# EasyEDA Pro project PCB_ArduinoArcadeCardReader_ESP32C3MINI.epro

# Board PCB_PCB_Aime_card_reader_ESP32C3MINI_2024-11-08
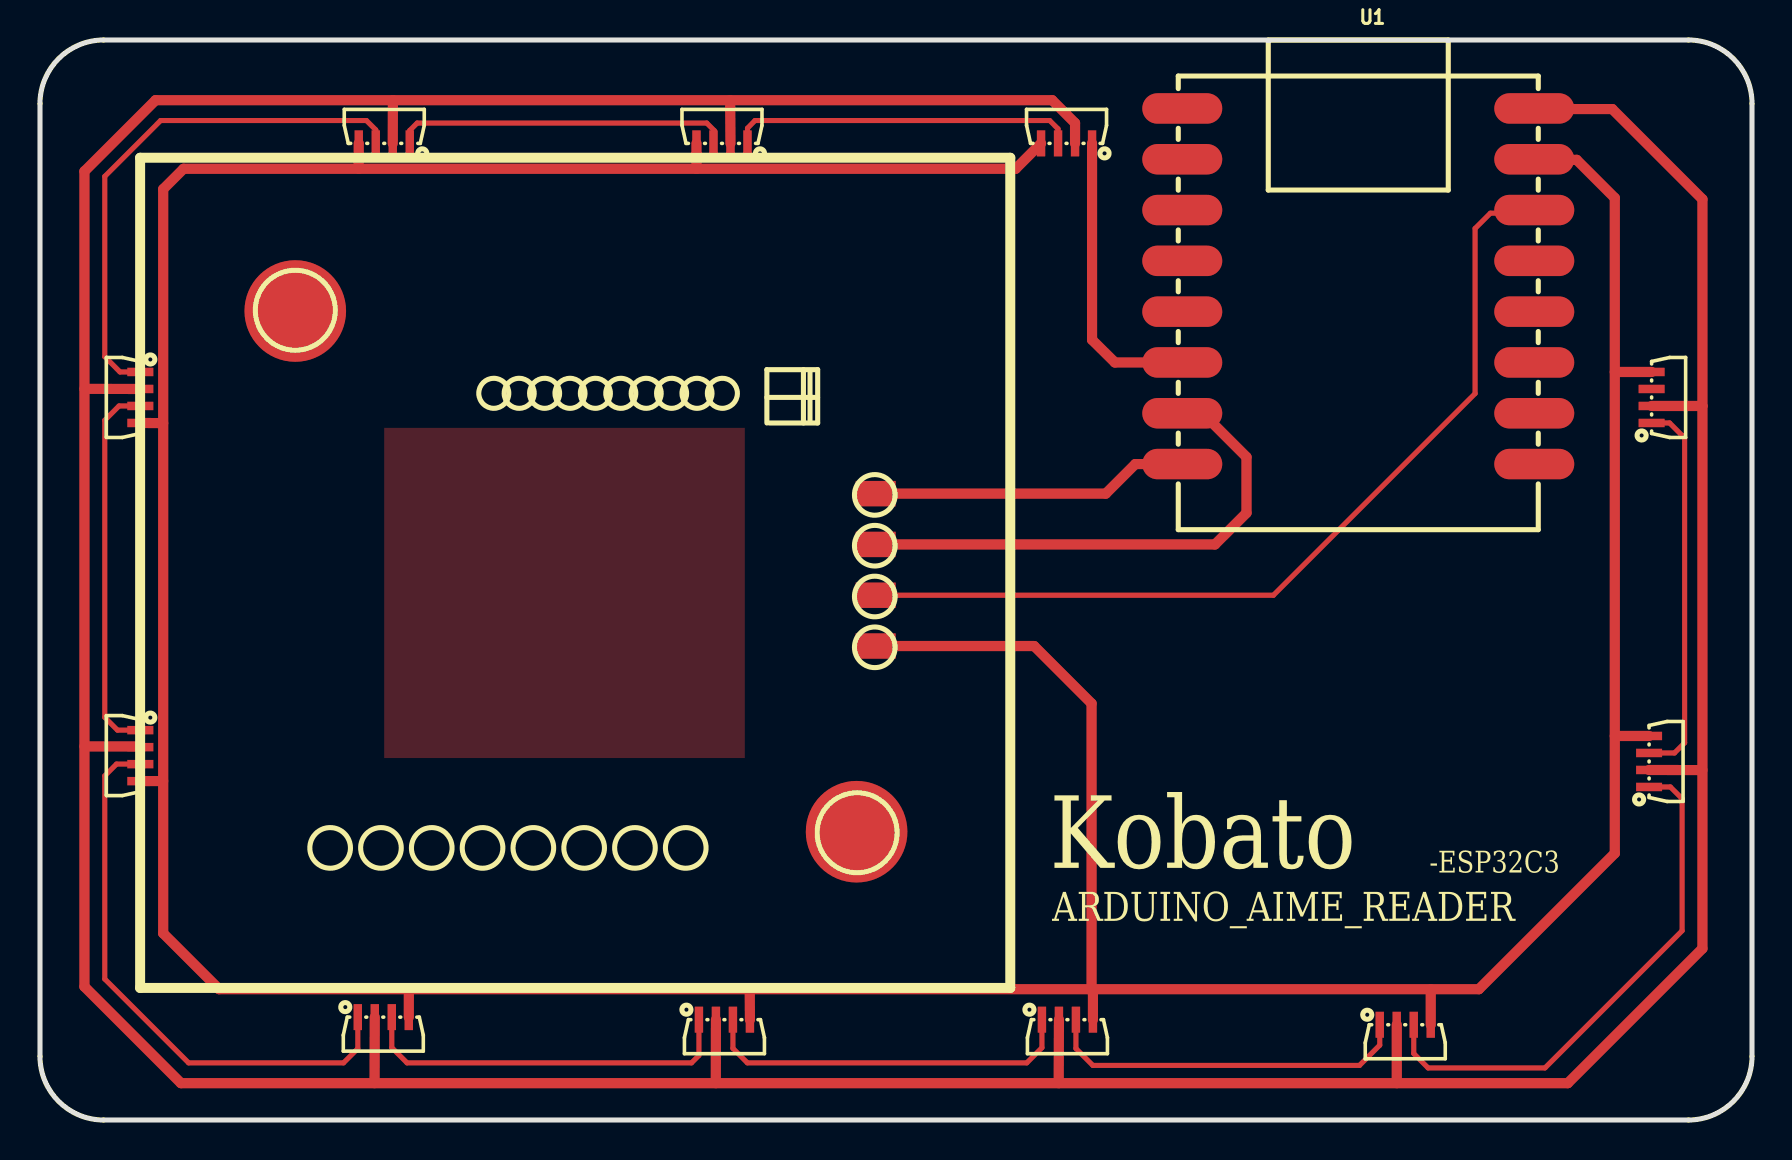
[diagram p0: board, top side]
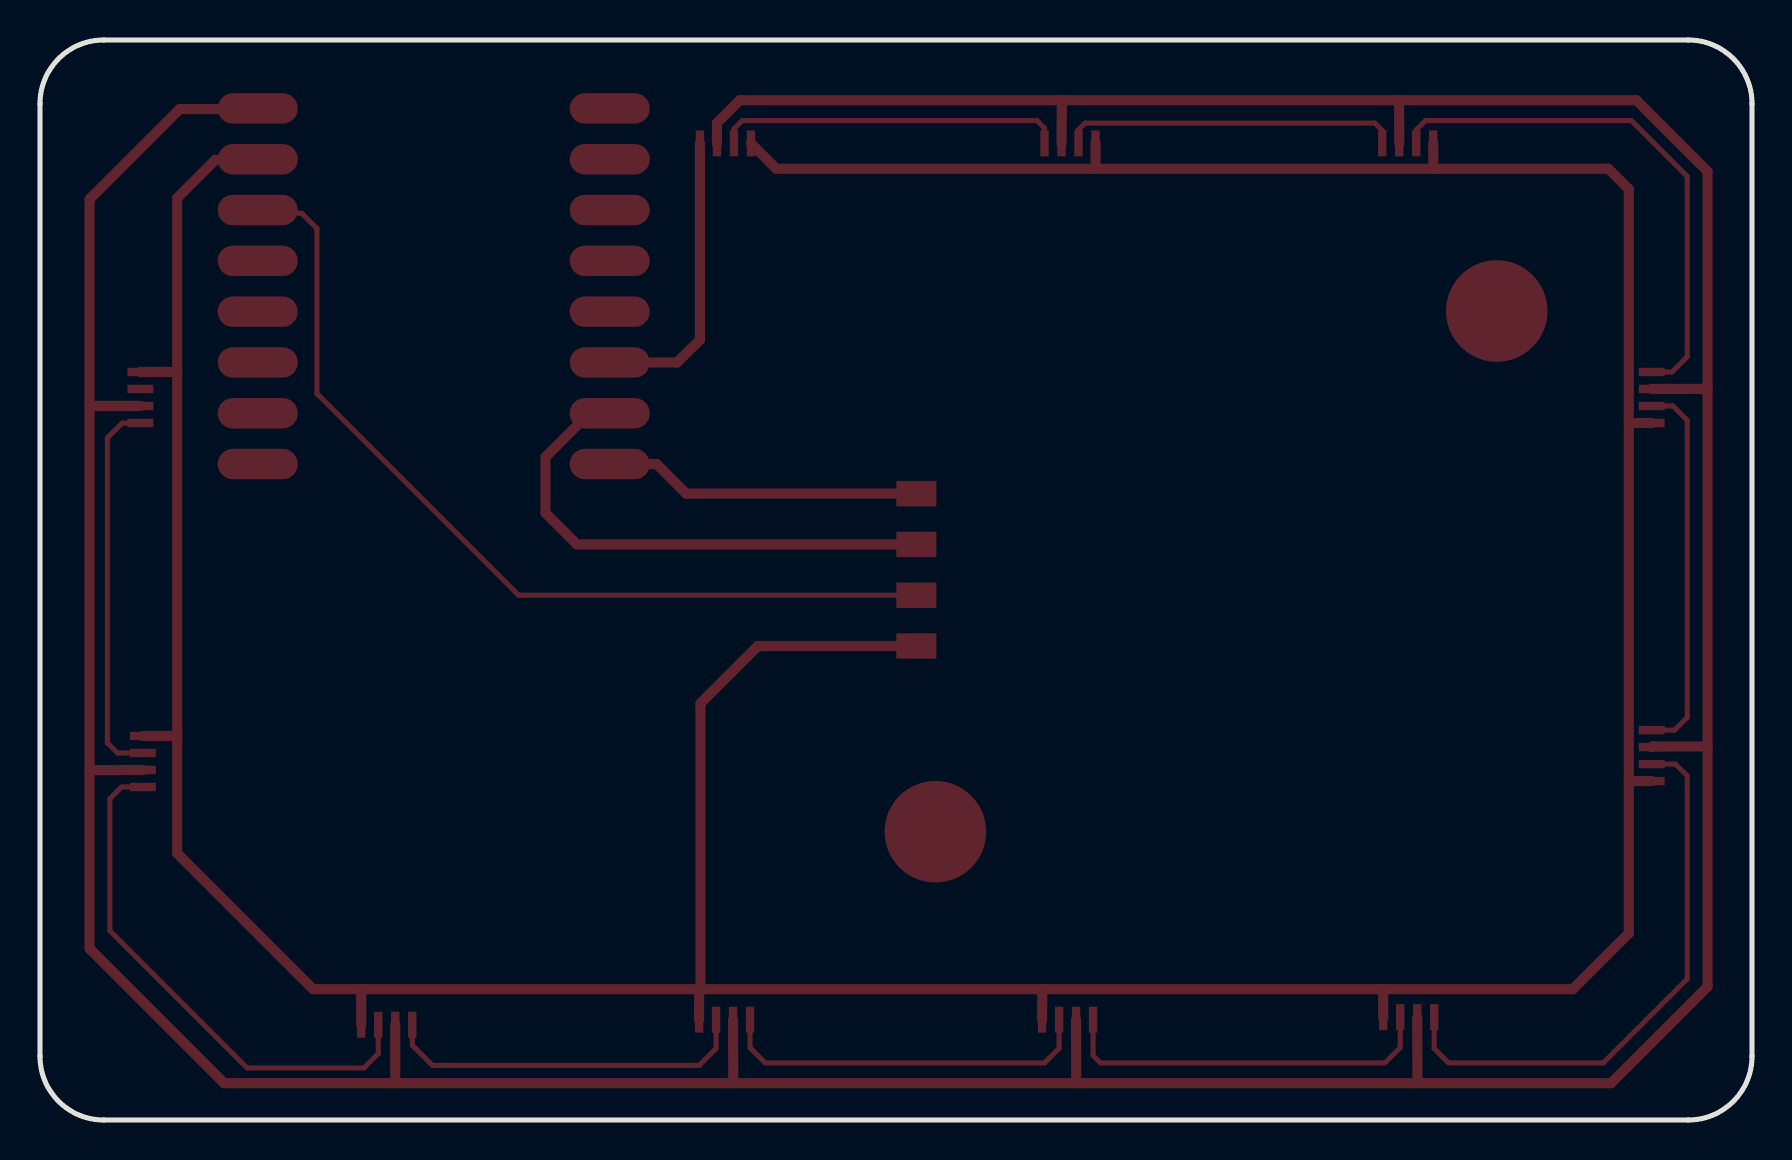
[diagram p1: board, bottom side, seen from below]

Outline 85.6 x 54 mm; copper layers: Top Layer, Bottom Layer. Coordinates in mm from the lower left corner of the outline.
Outline path: 0,50.82 arc(0.93,53.07) 3.18,54 82.42,54 arc(84.67,53.07) 85.6,50.82 85.6,3.18 arc(84.67,0.93) 82.42,0 3.18,0 arc(0.93,0.93) 0,3.18 0,50.82
Stack: Top Layer 0.035mm / Dielectric1 1.51mm FR4 er 4.5 / Bottom Layer 0.035mm

## Design rules (mm)
spacing Default (default): track to track 0.152, other pairs 0 to 0.152
track width Default (default): min 0.254, default 0.254, max 25.4
differential pair differentialPair (default): width min 0.127, default 0.254, max 2.54; gap min 0.152, default 0.152
via Default (default): diameter min 0.61, default 0.61, max 100.025; hole min 0.305, default 0.305, max 59.995

## Placement (name value [footprint] x y rotation side)
FRM1  -  [FRM-PN532]  48.51 6.6 90 top
LED1  WS2812B-4020  [LED-SMD_WS2812B-4020]  80.58 36.13 270 top
LED2  WS2812B-4020  [LED-SMD_WS2812B-4020]  80.45 17.93 270 top
LED3  WS2812B-4020  [LED-SMD_WS2812B-4020]  68.26 4.76 180 top
LED4  WS2812B-4020  [LED-SMD_WS2812B-4020]  51.37 5.02 180 top
LED5  WS2812B-4020  [LED-SMD_WS2812B-4020]  34.22 5.02 180 top
LED6  WS2812B-4020  [LED-SMD_WS2812B-4020]  17.16 5.14 180 top
LED7  WS2812B-4020  [LED-SMD_WS2812B-4020]  5.02 18.22 90 top
LED8  WS2812B-4020  [LED-SMD_WS2812B-4020]  5.02 36.13 90 top
LED9  WS2812B-4020  [LED-SMD_WS2812B-4020]  17.21 48.83 0 top
LED10  WS2812B-4020  [LED-SMD_WS2812B-4020]  34.1 48.83 0 top
LED11  WS2812B-4020  [LED-SMD_WS2812B-4020]  51.33 48.83 0 top
NOREF  -  [Pad_e126]  12.76 40.45 90 top
NOREF#2  -  [Pad_e128]  41.78 26.24 90 top
NOREF#3  -  [Pad_e129]  41.78 28.78 90 top
NOREF#4  -  [Pad_e125]  40.83 14.41 90 top
NOREF#5  -  [Pad_e130]  41.78 31.32 90 top
NOREF#6  -  [Pad_e127]  41.78 23.7 90 top
U1  ESP32C3 supermini  [ESP32C3-SUPERMINI]  65.91 52.2 0 top

## Footprints (pads in the part's own frame, mm; a bottom-side part is the same pattern mirrored in y, then rotated)
ESP32C3-SUPERMINI
  oval 4x1.524 smd: 1(-8.8,-1.62) 2(-8.8,-4.16) 3(-8.8,-6.7) 4(-8.8,-9.24) 5(-8.8,-11.78) 6(-8.8,-14.32) 7(-8.8,-16.86) 8(-8.8,-19.4) 9(8.8,-19.4) 10(8.8,-16.86) 11(8.8,-14.32) 12(8.8,-11.78) 13(8.8,-9.24) 14(8.8,-6.7) 15(8.8,-4.16) 16(8.8,-1.62)
LED-SMD_WS2812B-4020
  rect 0.42x1.3 smd: 1(1.275,0) 2(0.425,0) 3(-0.425,0) 4(-1.275,0)
Pad_e125
  round 5.08 smd: 1(0,0)
Pad_e126
  round 5.08 smd: 1(0,0)
Pad_e127
  rect 1.27x2 smd: 2(0,0)
Pad_e128
  rect 1.27x2 smd: 3(0,0)
Pad_e129
  rect 1.27x2 smd: 4(0,0)
Pad_e130
  rect 1.27x2 smd: 5(0,0)

## Nets
+5V: LED1.2 LED2.2 LED3.2 LED4.2 LED5.2 LED6.2 LED7.2 LED8.2 LED9.2 LED10.2 LED11.2 U1.16
GND: LED1.4 LED2.4 LED3.4 LED4.4 LED5.4 LED6.4 LED7.4 LED8.4 LED9.4 LED10.4 LED11.4 NOREF#6.2 U1.15
VCC: NOREF#2.3 U1.14
LED: LED11.1 U1.6
LED1_3: LED1.3
LED2_3: LED1.1 LED2.3
LED3_3: LED2.1 LED3.3
LED4_3: LED3.1 LED4.3
LED5_3: LED4.1 LED5.3
LED6_3: LED5.1 LED6.3
LED7_3: LED6.1 LED7.3
LED8_3: LED7.1 LED8.3
LED9_3: LED8.1 LED9.3
LED10_3: LED9.1 LED10.3
LED11_3: LED10.1 LED11.3
U1_1: U1.1
U1_2: U1.2
U1_3: U1.3
U1_4: U1.4
U1_5: U1.5
U1_9: U1.9
U1_10: U1.10
U1_11: U1.11
U1_12: U1.12
U1_13: U1.13
UART_RXD: NOREF#3.4 U1.7
UART_TXD: NOREF#5.5 U1.8

Pads without a net: NOREF 1; NOREF#4 1

## Routing (per net, layer and track width the routed paths; a pad name or vN(x,y) marks a point on that pad's centre or on a via; arc(x,y) is an arc through that point)
+5V: length 253.9
  Top Layer w0.508: LED7.2 4.98,18.68 2.22,18.68 ; 17.64,48.83 17.65,50.99 ; LED11.2 51.75,49.85 50.61,50.99 5.78,50.99 2.22,47.43 2.22,6.67 7.05,1.84 76.39,1.84 83.12,8.57 83.12,35.7 ; 75.23,50.55 78.61,50.55 83.12,46.04 83.12,35.7 ; 34.52,48.83 34.51,50.99 ; 83.12,35.7 LED1.2 ; 80.45,17.5 83.12,17.5 ; LED5.2 33.79,1.84 ; LED4.2 50.93,1.84 ; 5.02,36.55 2.22,36.56 ; 67.84,4.76 67.84,1.84 ; LED6.2 16.73,1.84
GND: length 236.5
  Top Layer w0.508: LED11.4 48.78,47.56 7.18,47.56 6.16,46.54 6.16,9.33 8.95,6.54 52.65,6.54 ; LED9.4 15.93,47.56 ; 75.23,48.01 76.83,48.01 78.74,46.1 78.74,13.34 71.95,6.54 52.65,6.54 ; LED7.4 6.16,16.95 ; LED8.4 6.16,34.84 ; 80.58,37.4 78.74,37.4 ; LED2.4 78.74,19.2 ; 52.65,6.54 LED4.4 ; 52.58,6.54 52.58,20.83 49.71,23.7 NOREF#6.2 ; 18.44,5.14 18.44,6.54 ; LED5.4 35.49,6.54 ; LED10.4 32.82,47.56 ; LED3.4 69.54,6.54
VCC: length 46.2
  Top Layer w0.254: 75.23,45.34 72.52,45.34 71.76,44.58 71.76,36.32 61.67,26.24 NOREF#2.3
LED: length 14.8
  Top Layer w0.508: 57.11,37.88 53.75,37.88 52.6,39.01 LED11.1
LED2_3: length 19.2
  Top Layer w0.254: LED1.1 81.48,34.85 82.23,34.1 82.23,18.86 81.72,18.35 LED2.3
LED3_3: length 26.5
  Top Layer w0.254: LED2.1 81.52,16.65 82.11,16.07 82.11,9.46 75.25,2.6 69.41,2.6 68.69,3.32 LED3.3
LED4_3: length 18.4
  Top Layer w0.254: LED4.3 51.8,3.58 52.64,2.73 65.98,2.73 66.99,3.74 LED3.1
LED5_3: length 18.9
  Top Layer w0.254: LED5.3 34.65,3.58 35.37,2.86 49.34,2.86 50.1,3.61 LED4.1
LED6_3: length 19.1
  Top Layer w0.254: LED5.1 32.95,3.23 32.58,2.86 18.35,2.86 17.59,3.62 LED6.3
LED7_3: length 28.4
  Top Layer w0.254: 5.02,17.8 3.83,17.8 3.24,17.21 3.24,7.05 7.43,2.86 15.18,2.86 15.89,3.57 15.89,5.14
LED8_3: length 19
  Top Layer w0.254: LED8.3 3.95,35.7 3.24,34.99 3.24,20.13 3.87,19.49 LED7.1
LED9_3: length 26.7
  Top Layer w0.254: LED8.1 4,37.4 3.24,38.16 3.24,47.18 6.03,49.97 16.32,49.97 16.79,49.5 LED9.3
LED10_3: length 16.8
  Top Layer w0.254: LED9.1 18.49,49.48 18.86,49.85 33.34,49.85 33.72,49.47 33.72,48.87 LED10.3
LED11_3: length 17.3
  Top Layer w0.254: LED10.1 35.37,49.59 35.75,49.97 50.48,49.97 50.9,49.56 50.9,48.83
UART_RXD: length 26.1
  Top Layer w0.508: NOREF#3.4 58.75,28.78 60.33,30.35 60.33,33.15 58.14,35.34 U1.7
UART_TXD: length 15.9
  Top Layer w0.508: NOREF#5.5 53.29,31.32 54.77,32.8 57.11,32.8

## Copper pours and planes (outline as drawn; the poured copper is in the pictures)
(no net) on Top Layer: 17.21,34.61 35.24,34.61 35.24,18.1 17.21,18.1

## Text on the board
Top Silkscreen Layer: -ESP32C3 | ARDUINO_AIME_READER | Kobato
